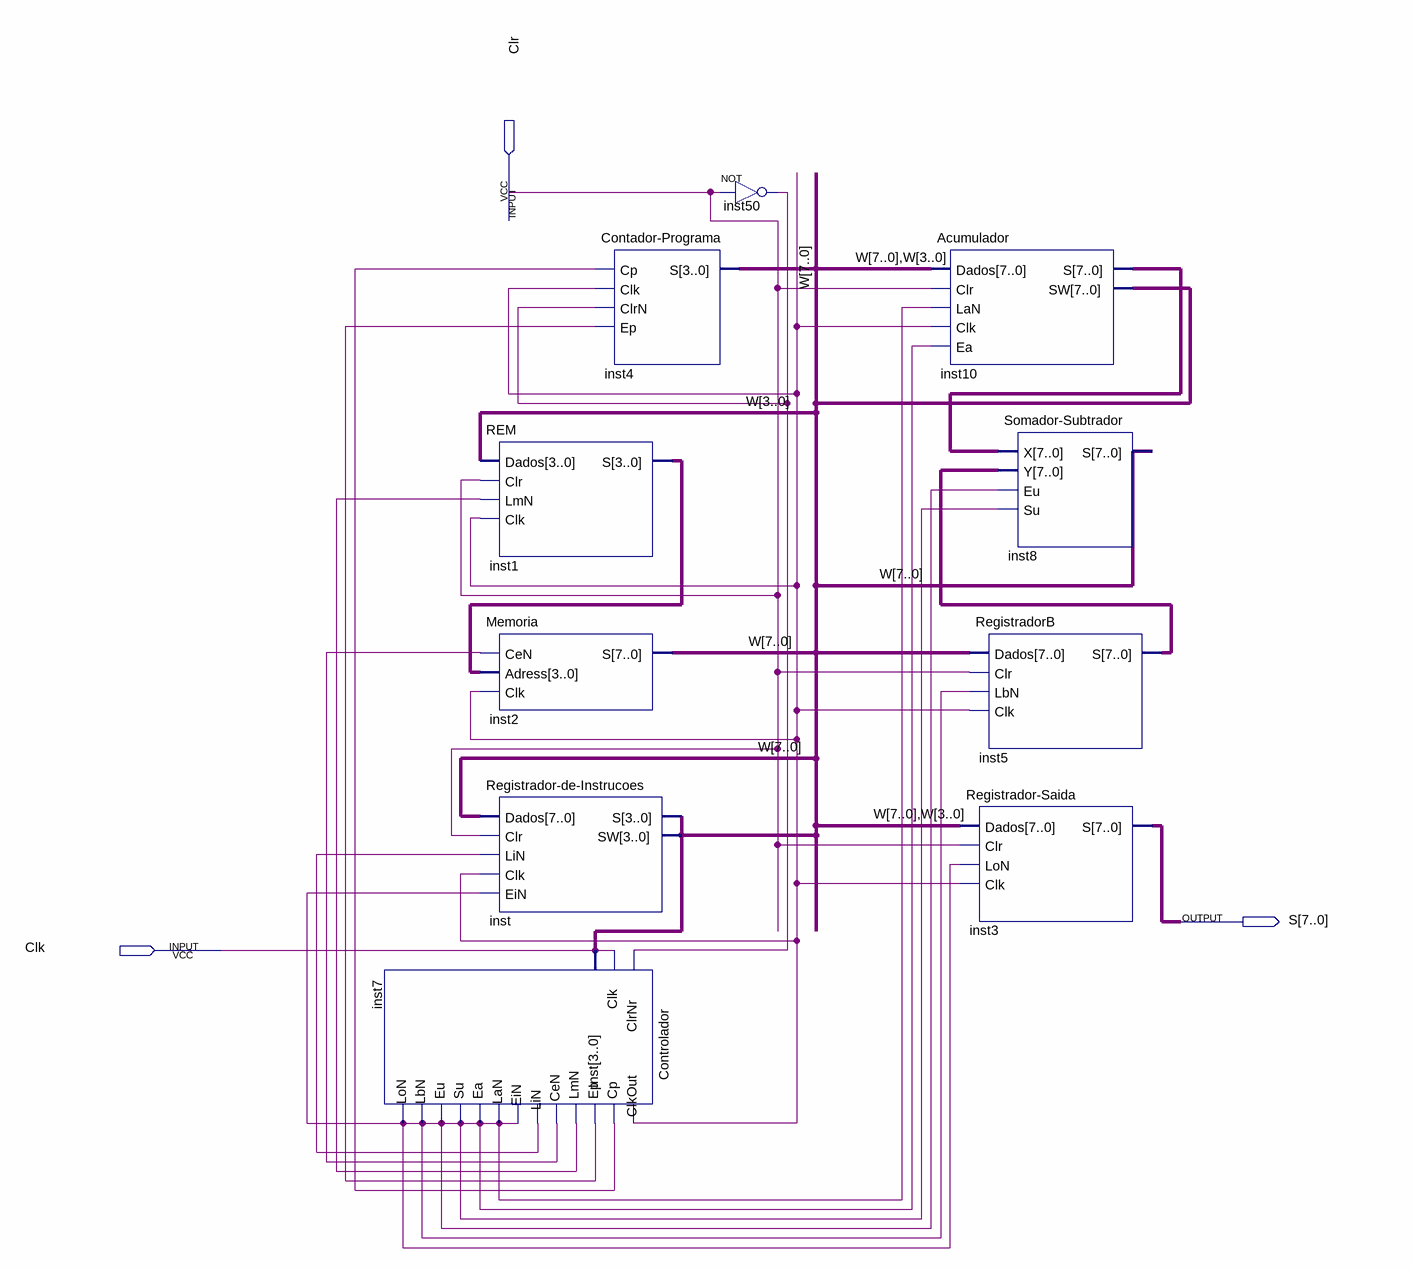
[diagram p0: schematic sheet]
// Quartus schematic Micropro.bdf as structural Verilog: 10 symbols, 3 pins
module Micropro (
  input  Clr,
  input  Clk,
  output [7:0] S
);

  wire inst7_cen, inst7_clkout, inst7_cp, inst7_ein, inst7_ep, inst7_lin, inst7_lmn, inst50_out;
  wire [3:0] inst1_s;
  wire [7:0] inst5_s, inst10_s, W;

  Controlador inst7 (
    .ClrNr(inst50_out), .Clk(Clk), .Inst({W, W[3:0]}), .ClkOut(inst7_clkout), .Cp(inst7_cp), .Ep(inst7_ep),
    .LmN(inst7_lmn), .CeN(inst7_cen), .LiN(inst7_lin), .EiN(inst7_ein), .LaN(inst7_ein), .Ea(inst7_ein),
    .Su(inst7_ein), .Eu(inst7_ein), .LbN(inst7_ein), .LoN(inst7_ein));
  REM inst1 (.Dados(W[3:0]), .Clr(Clr), .LmN(inst7_lmn), .Clk(inst7_clkout), .S(inst1_s));
  Memoria inst2 (.CeN(inst7_cen), .Adress(inst1_s), .Clk(inst7_clkout), .S(W));
  \Registrador-de-Instrucoes  inst (
    .Dados(W), .Clr(Clr), .LiN(inst7_lin), .Clk(inst7_clkout), .EiN(inst7_ein), .S({W, W[3:0]}),
    .SW({W, W[3:0]}));
  \Contador-Programa  inst4 (.Cp(inst7_cp), .Clk(inst7_clkout), .ClrN(inst50_out), .Ep(inst7_ep), .S({W, W[3:0]}));
  not inst50 (inst50_out, Clr);
  Acumulador inst10 (
    .Dados({W, W[3:0]}), .Clr(Clr), .LaN(inst7_ein), .Clk(inst7_clkout), .Ea(inst7_ein), .S(inst10_s),
    .SW({W, W[3:0]}));
  RegistradorB inst5 (.Dados({W, W[3:0]}), .Clr(Clr), .LbN(inst7_ein), .Clk(inst7_clkout), .S(inst5_s));
  \Registrador-Saida  inst3 (.Dados({W, W[3:0]}), .Clr(Clr), .LoN(inst7_ein), .Clk(inst7_clkout), .S(S));
  \Somador-Subtrador  inst8 (.X(inst10_s), .Y(inst5_s), .Eu(inst7_ein), .Su(inst7_ein), .S(W));
endmodule
